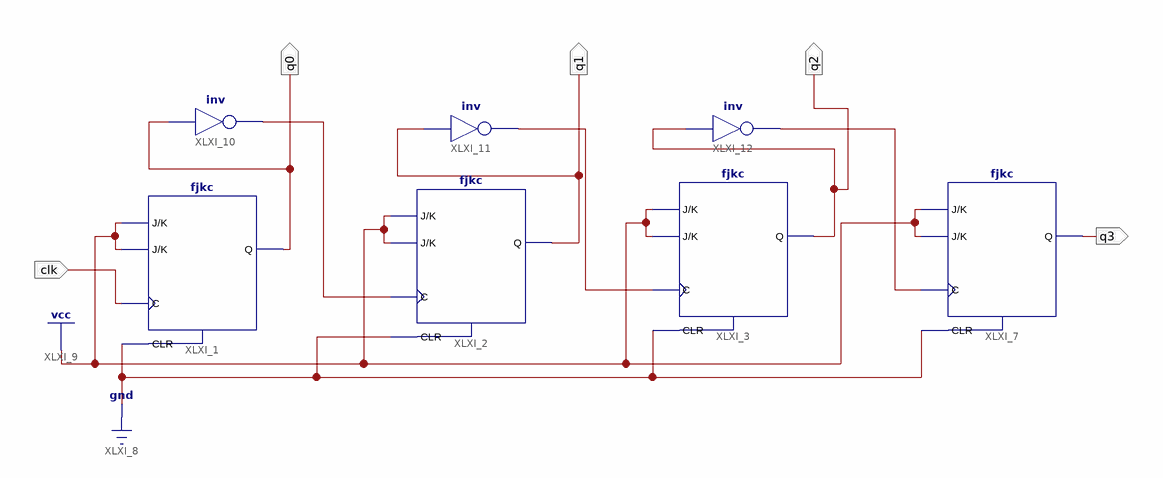
[diagram p0: schematic sheet 1]
// Xilinx ISE schematic AAA.sch (virtex7) as structural Verilog: 7 symbols, 5 ports
module AAA (
  input  clk,
  output q3,
  output q0,
  output q1,
  output q2
);

  wire XLXN_23, XLXN_28, XLXN_30;

  fjkc XLXI_1 (.C(clk), .CLR(1'b0), .J(1'b1), .K(1'b1), .Q(q0));
  fjkc XLXI_2 (.C(XLXN_23), .CLR(1'b0), .J(1'b1), .K(1'b1), .Q(q1));
  fjkc XLXI_3 (.C(XLXN_28), .CLR(1'b0), .J(1'b1), .K(1'b1), .Q(q2));
  fjkc XLXI_7 (.C(XLXN_30), .CLR(1'b0), .J(1'b1), .K(1'b1), .Q(q3));
  not XLXI_10 (XLXN_23, q0);
  not XLXI_11 (XLXN_28, q1);
  not XLXI_12 (XLXN_30, q2);
endmodule
